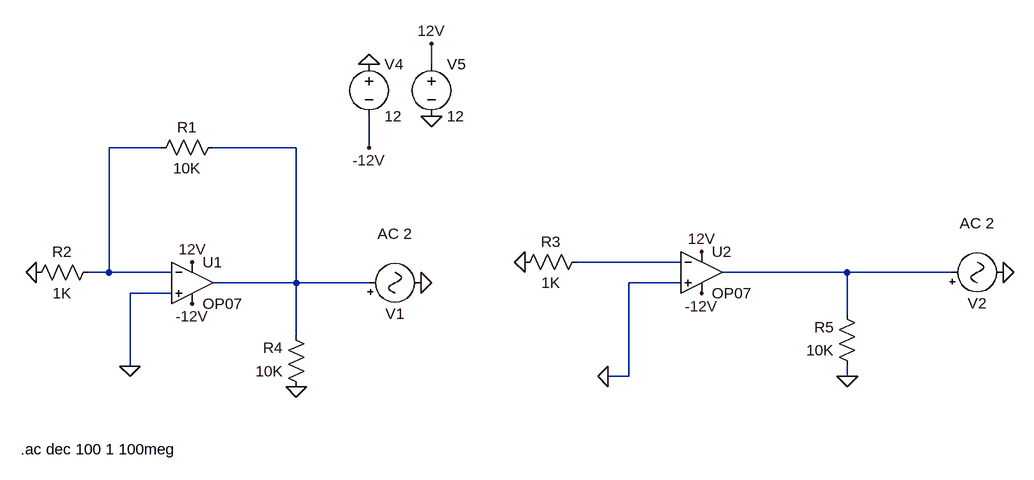
[diagram p0: schematic Draft4.asc]
Draft4.asc, the LTspice schematic file:
Version 4
SHEET 1 1364 680
WIRE 464 -176 464 -208
WIRE 48 -48 -32 -48
WIRE 256 -48 128 -48
WIRE 368 -48 368 -96
WIRE 848 128 688 128
WIRE -32 144 -32 -48
WIRE -32 144 -64 144
WIRE 64 144 -32 144
WIRE 1104 144 912 144
WIRE 1264 144 1104 144
WIRE 256 160 256 -48
WIRE 256 160 128 160
WIRE 368 160 256 160
WIRE 848 160 768 160
WIRE 64 176 0 176
WIRE 1104 208 1104 144
WIRE 256 240 256 160
WIRE 0 288 0 176
WIRE 768 304 768 160
WIRE 768 304 736 304
WIRE 1104 304 1104 288
FLAG -144 144 0
FLAG 256 320 0
FLAG 608 128 0
FLAG 1104 304 0
FLAG 464 -208 12V
FLAG 464 -96 0
FLAG 368 -176 0
FLAG 368 -48 -12V
FLAG 96 128 12V
FLAG 880 112 12V
FLAG 96 192 -12V
FLAG 880 176 -12V
FLAG 0 288 0
FLAG 736 304 0
FLAG 448 160 0
FLAG 1344 144 0
SYMBOL OpAmps\\OP07 96 96 R0
SYMATTR InstName U1
SYMBOL OpAmps\\OP07 880 80 R0
SYMATTR InstName U2
SYMBOL res 144 -64 R90
WINDOW 0 0 56 VBottom 2
WINDOW 3 32 56 VTop 2
SYMATTR InstName R1
SYMATTR Value 10K
SYMBOL res -48 128 R90
WINDOW 0 0 56 VBottom 2
WINDOW 3 32 56 VTop 2
SYMATTR InstName R2
SYMATTR Value 1K
SYMBOL res 704 112 R90
WINDOW 0 0 56 VBottom 2
WINDOW 3 32 56 VTop 2
SYMATTR InstName R3
SYMATTR Value 1K
SYMBOL res 272 336 R180
WINDOW 0 36 76 Left 2
WINDOW 3 36 40 Left 2
SYMATTR InstName R4
SYMATTR Value 10K
SYMBOL res 1120 304 R180
WINDOW 0 36 76 Left 2
WINDOW 3 36 40 Left 2
SYMATTR InstName R5
SYMATTR Value 10K
SYMBOL Misc\\signal 352 160 R270
WINDOW 0 -32 56 VBottom 2
WINDOW 3 32 56 VTop 2
WINDOW 123 60 56 VTop 2
WINDOW 39 0 0 Left 0
SYMATTR InstName V1
SYMATTR Value ""
SYMATTR Value2 AC 2
SYMBOL Misc\\signal 1248 144 R270
WINDOW 0 -32 56 VBottom 2
WINDOW 3 32 56 VTop 2
WINDOW 123 60 56 VTop 2
WINDOW 39 0 0 Left 0
SYMATTR InstName V2
SYMATTR Value ""
SYMATTR Value2 AC 2
SYMBOL voltage 368 -192 R0
WINDOW 123 0 0 Left 0
WINDOW 39 0 0 Left 0
SYMATTR InstName V4
SYMATTR Value 12
SYMBOL voltage 464 -192 R0
WINDOW 123 0 0 Left 0
WINDOW 39 0 0 Left 0
SYMATTR InstName V5
SYMATTR Value 12
TEXT -168 416 Left 2 !.ac dec 100 1 100meg

The netlist it stands for:
* Draft4.asc
XU1 0 N001 12V -12V N002 LT1001  ; OP07, pins In+ In- V+ V- OUT
XU2 0 N003 12V -12V N004 LT1001  ; OP07, pins In+ In- V+ V- OUT
R1 N002 N001 10K
R2 N001 0 1K
R3 N003 0 1K
R4 0 N002 10K
R5 0 N004 10K
V1 N002 0 AC 2
V2 N004 0 AC 2
V4 0 -12V 12
V5 12V 0 12
.ac dec 100 1 100meg
.lib LTC.lib
.backanno
.end